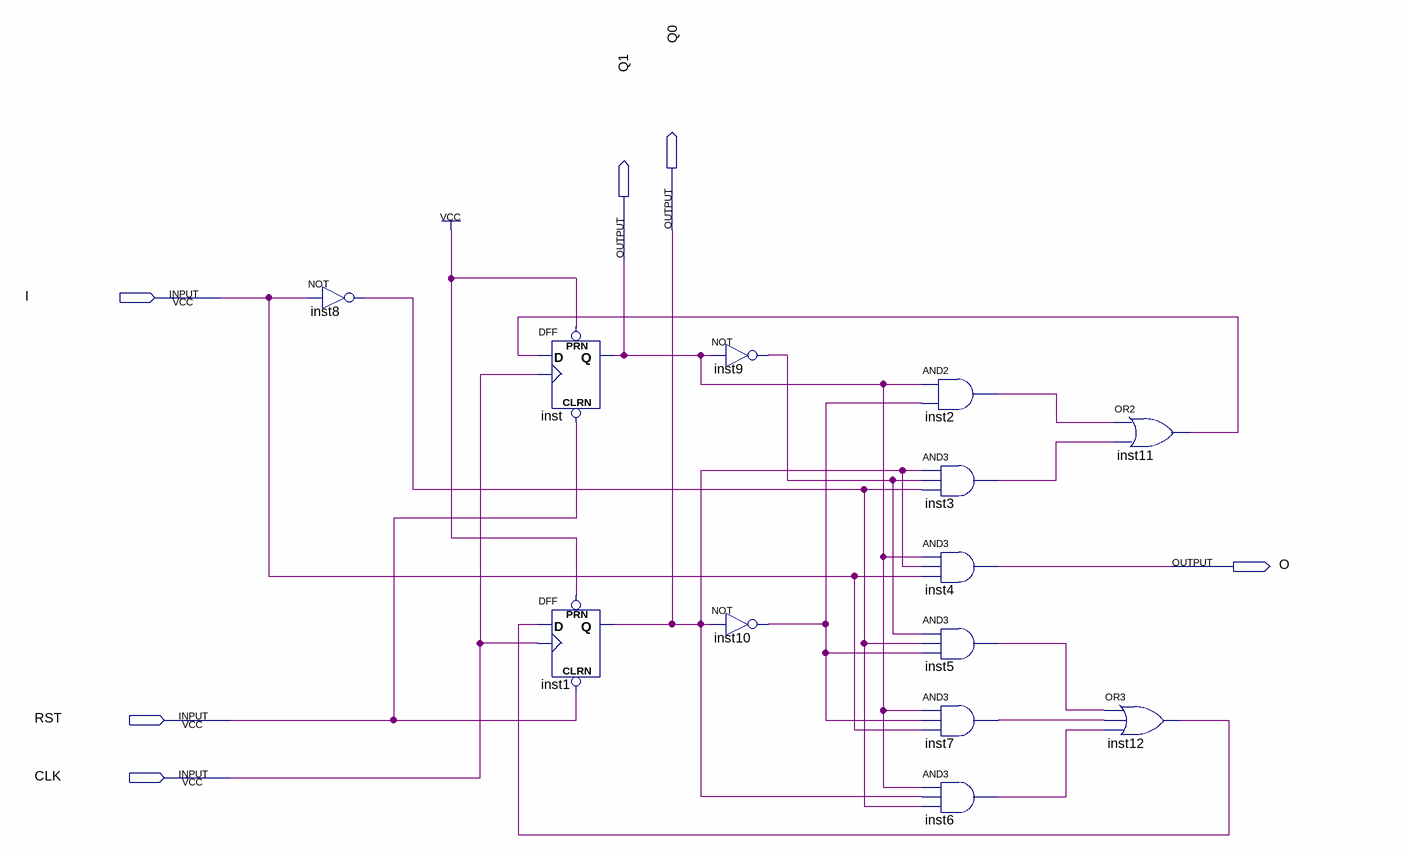
[diagram p0: schematic sheet]
// Quartus schematic Lab02_21522233.bdf as structural Verilog: 13 symbols, 6 pins
module Lab02_21522233 (
  input  I,
  input  RST,
  input  CLK,
  output Q0,
  output Q1,
  output O
);

  wire inst2_out, inst3_out, inst5_out, inst6_out, inst7_out, inst8_out, inst9_out, inst10_out, inst11_out,
       inst12_out;

  not inst8 (inst8_out, I);
  DFF inst (.CLRN(RST), .CLK(CLK), .D(inst11_out), .PRN(1'b1), .Q(Q1));
  DFF inst1 (.CLRN(RST), .CLK(CLK), .D(inst12_out), .PRN(1'b1), .Q(Q0));
  not inst9 (inst9_out, Q1);
  not inst10 (inst10_out, Q0);
  and inst2 (inst2_out, Q1, inst10_out);
  and inst3 (inst3_out, Q0, inst9_out, inst8_out);
  and inst4 (O, Q1, Q0, I);
  and inst5 (inst5_out, inst9_out, inst8_out, inst10_out);
  and inst7 (inst7_out, Q1, inst10_out, I);
  and inst6 (inst6_out, Q1, Q0, inst8_out);
  or inst11 (inst11_out, inst2_out, inst3_out);
  or inst12 (inst12_out, inst5_out, inst7_out, inst6_out);
endmodule
